# EAGLE schematic untitled (EAGLE 9.6.2)
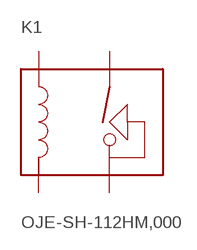
[diagram p0: schematic, sheet 1]

## Parts
K1  OJE-SH-112HM,000  [OJE-SH-112HM,000]
Unconnected: K1.A1 K1.A2 K1.NC K1.NO

## Library data of the parts
K1 = Relay:OJE-SH-112HM,000: RELAY GEN PURPOSE SPST 10A 12V Manufacturer's datasheet <https://www.te.com/commerce/DocumentDelivery/DDEController?Action=srchrtrv&DocNm=1461402&DocType=Customer+Drawing&DocLang=English>; CREATED_BY: PCBLayout.com; DIGIKEY_PART_NUMBER: PB876-ND; MANUFACTURER: TE Connectivity Potter & Brumfield Relays; MANUFACTURER_PART_NUMBER: OJE-SH-112HM,000